# EAGLE schematic INS 2 (EAGLE 9.6.2)
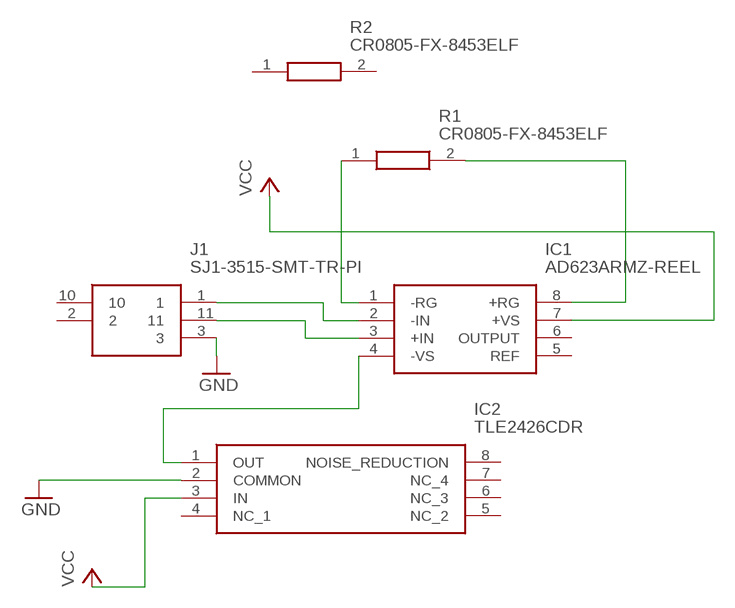
[diagram p0: schematic, sheet 1]

## Parts
IC1  AD623ARMZ-REEL  [SOP65P490X110-8N]
IC2  TLE2426CDR  [SOIC127P600X175-8N]
J1  SJ1-3515-SMT-TR-PI  [SJ13515SMTTRPI]
R1  CR0805-FX-8453ELF  [RESC2012X60N]
R2  CR0805-FX-8453ELF  [RESC2012X60N]

## Nets
GND: IC2.2(COMMON) J1.3
N$1: IC1.2(-IN) J1.1
N$2: IC1.4(-VS) IC2.1(OUT)
N$3: IC1.1(-RG) R1.1
N$4: IC1.8(+RG) R1.2
N$5: IC1.3(+IN) J1.11
VCC: IC1.7(+VS) IC2.3(IN)
Unconnected: IC1.5(REF) IC1.6(OUTPUT) IC2.4(NC_1) IC2.5(NC_2) IC2.6(NC_3) IC2.7(NC_4) IC2.8(NOISE_REDUCTION) J1.2 J1.10 R2.1 R2.2

## Library data of the parts
IC1 = SamacSys_Parts:AD623ARMZ-REEL: Instrumentation Amplifiers uSOIC SINGLE SUPPLY RAIL-RAIL L/C IN AMP Source: Datasheet <https://www.analog.com/media/en/technical-documentation/data-sheets/AD623.pdf>; DESCRIPTION: Instrumentation Amplifiers uSOIC SINGLE SUPPLY RAIL-RAIL L/C IN AMP; HEIGHT: 1.1mm; MANUFACTURER_NAME: Analog Devices; MANUFACTURER_PART_NUMBER: AD623ARMZ-REEL; MOUSER_PART_NUMBER: 584-AD623ARMZ-R; MOUSER_PRICE-STOCK: https://www.mouser.co.uk/ProductDetail/Analog-Devices/AD623ARMZ-REEL?qs=NmRFExCfTkEONCyO31EcpA%3D%3D
IC2 = SamacSys_Parts:TLE2426CDR: The 'Rail Splitter' Precision Virtual Ground Source: Datasheet <http://www.ti.com/lit/gpn/TLE2426>; DESCRIPTION: The 'Rail Splitter' Precision Virtual Ground; HEIGHT: 1.75mm; MANUFACTURER_NAME: Texas Instruments; MANUFACTURER_PART_NUMBER: TLE2426CDR; MOUSER_PART_NUMBER: 595-TLE2426CDR; MOUSER_PRICE-STOCK: https://www.mouser.co.uk/ProductDetail/Texas-Instruments/TLE2426CDR?qs=JbBXx2IvYcd3mBRQbzOwQw%3D%3D
J1 = SamacSys_Parts:SJ1-3515-SMT-TR-PI: 3.5 mm, Stereo, Right Angle, Surface Mount (SMT), 3 Conductors, 2 Internal Switches, Audio Jack Connector Source: Datasheet <https://www.sameskydevices.com/product/resource/sj1-351x-smt.pdf>; DESCRIPTION: 3.5 mm, Stereo, Right Angle, Surface Mount (SMT), 3 Conductors, 2 Internal Switches, Audio Jack Connector; HEIGHT: 5.3mm; MANUFACTURER_NAME: Same Sky; MANUFACTURER_PART_NUMBER: SJ1-3515-SMT-TR-PI; MOUSER_PART_NUMBER: 490-SJ13515SMTTRPI; MOUSER_PRICE-STOCK: https://www.mouser.co.uk/ProductDetail/Same-Sky/SJ1-3515-SMT-TR-PI?qs=WyjlAZoYn53E056e3qn8HQ%3D%3D
R1 = SamacSys_Parts:CR0805-FX-8453ELF: Thick Film Resistors - SMD 845K 1% Source: Datasheet <https://www.bourns.com/pdfs/chpreztr.pdf>; DESCRIPTION: Thick Film Resistors - SMD 845K 1%; HEIGHT: 0.6mm; MANUFACTURER_NAME: Bourns; MANUFACTURER_PART_NUMBER: CR0805-FX-8453ELF; MOUSER_PART_NUMBER: 652-CR0805FX-8453ELF; MOUSER_PRICE-STOCK: https://www.mouser.co.uk/ProductDetail/Bourns/CR0805-FX-8453ELF?qs=Ek4EPvi0xiBOXoSzjbK41Q%3D%3D
R2 = SamacSys_Parts:CR0805-FX-8453ELF: Thick Film Resistors - SMD 845K 1% Source: Datasheet <https://www.bourns.com/pdfs/chpreztr.pdf>; DESCRIPTION: Thick Film Resistors - SMD 845K 1%; HEIGHT: 0.6mm; MANUFACTURER_NAME: Bourns; MANUFACTURER_PART_NUMBER: CR0805-FX-8453ELF; MOUSER_PART_NUMBER: 652-CR0805FX-8453ELF; MOUSER_PRICE-STOCK: https://www.mouser.co.uk/ProductDetail/Bourns/CR0805-FX-8453ELF?qs=Ek4EPvi0xiBOXoSzjbK41Q%3D%3D; R3: 200